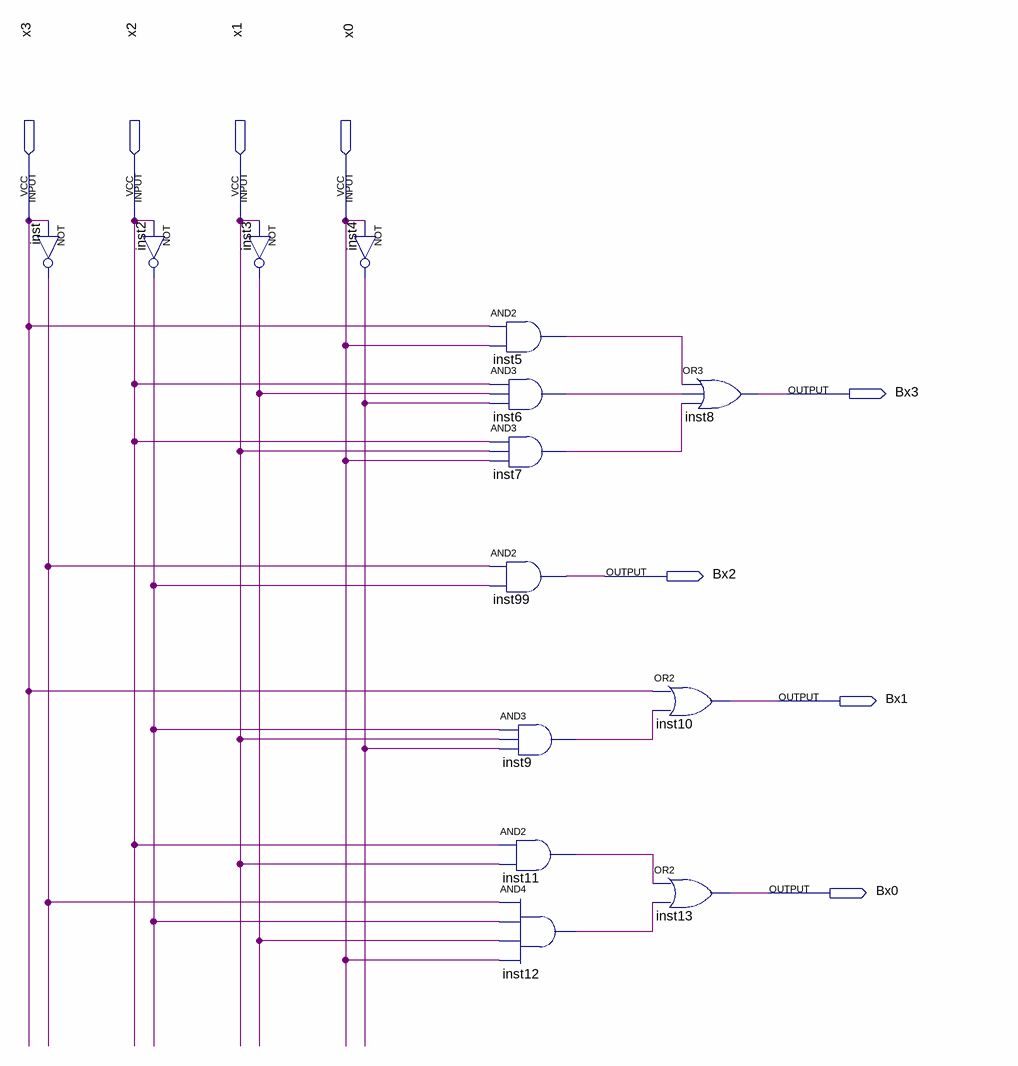
[diagram p0: schematic sheet]
// Quartus schematic Output.bdf as structural Verilog: 14 symbols, 8 pins
module Output (
  input  x3,
  input  x2,
  input  x1,
  input  x0,
  output Bx3,
  output Bx2,
  output Bx1,
  output Bx0
);

  wire inst2_out, inst3_out, inst4_out, inst5_out, inst6_out, inst7_out, inst9_out, inst11_out, inst12_out,
       inst_out;

  not inst (inst_out, x3);
  not inst2 (inst2_out, x2);
  not inst3 (inst3_out, x1);
  not inst4 (inst4_out, x0);
  and inst5 (inst5_out, x3, x0);
  and inst6 (inst6_out, x2, inst3_out, inst4_out);
  and inst7 (inst7_out, x2, x1, x0);
  and inst99 (Bx2, inst_out, inst2_out);
  and inst9 (inst9_out, inst2_out, x1, inst4_out);
  and inst11 (inst11_out, x2, x1);
  and inst12 (inst12_out, inst_out, inst2_out, inst3_out, x0);
  or inst8 (Bx3, inst5_out, inst6_out, inst7_out);
  or inst10 (Bx1, x3, inst9_out);
  or inst13 (Bx0, inst11_out, inst12_out);
endmodule
